# Altium schematic sheet PERIPHERAL.SchDoc
size A4
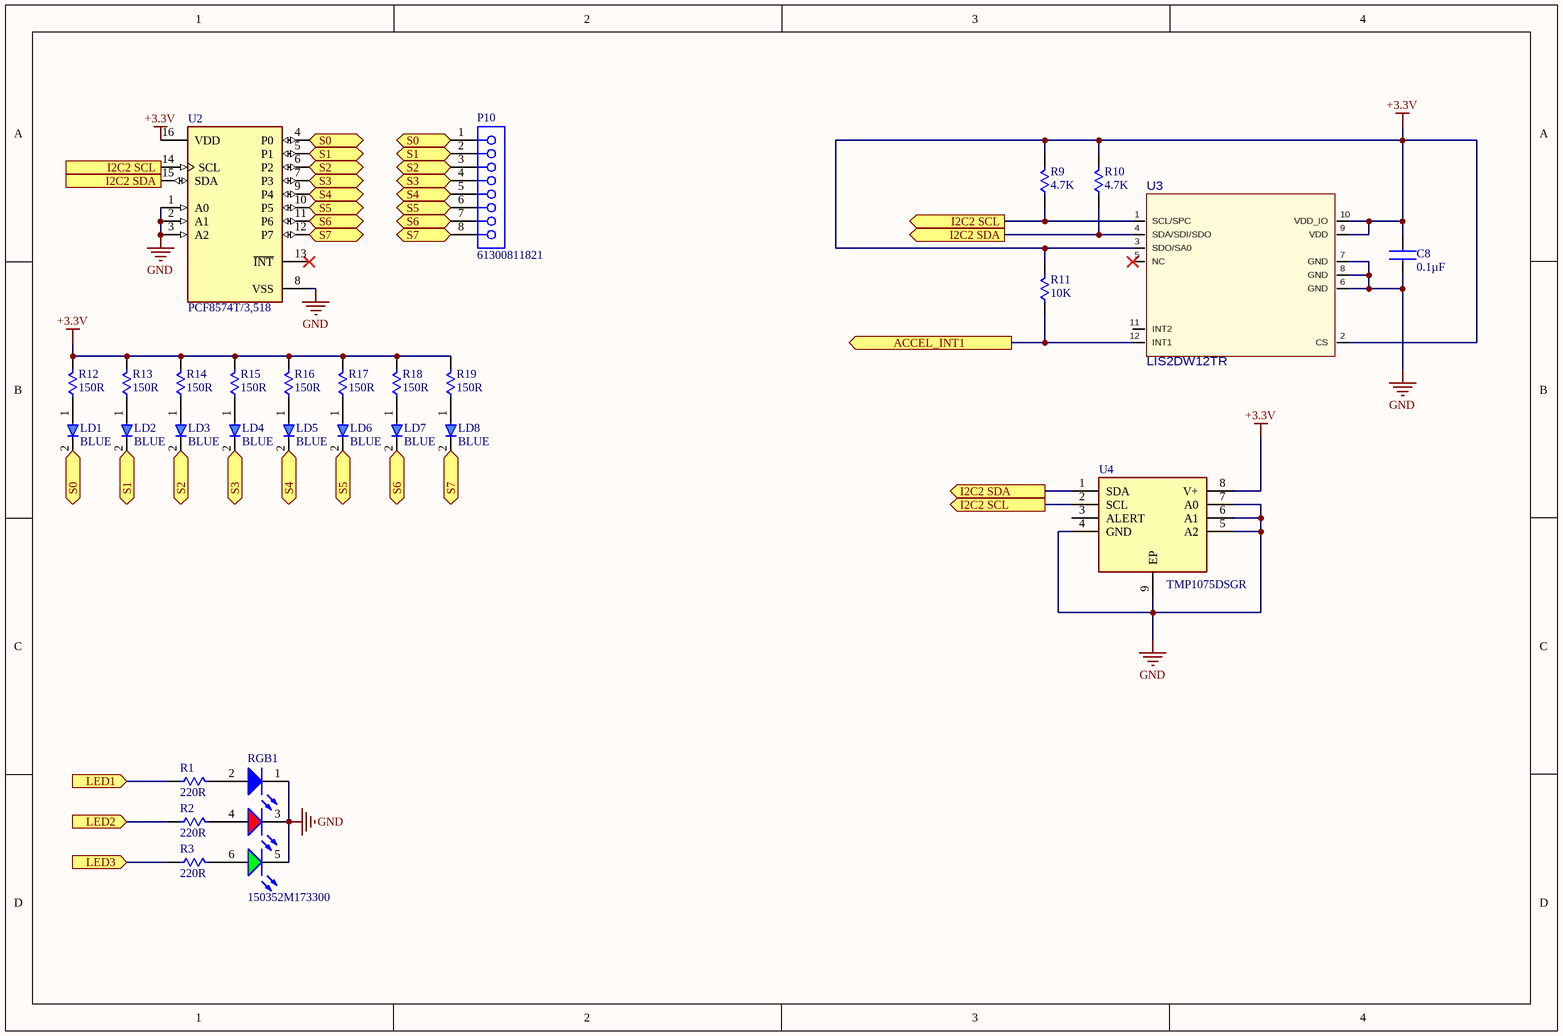
[diagram p0: PERIPHERAL.SchDoc]

## Parts
C8  0.1µF  [0402-CAP]
LD1  BLUE  [0603-LED-BLUE]
LD2  BLUE  [0603-LED-BLUE]
LD3  BLUE  [0603-LED-BLUE]
LD4  BLUE  [0603-LED-BLUE]
LD5  BLUE  [0603-LED-BLUE]
LD6  BLUE  [0603-LED-BLUE]
LD7  BLUE  [0603-LED-BLUE]
LD8  BLUE  [0603-LED-BLUE]
P10  61300811821  [61300811821]
R1  220R  [0603-RES]
R2  220R  [0603-RES]
R3  220R  [0603-RES]
R9  4.7K  [0603-RES]
R10  4.7K  [0603-RES]
R11  10K  [0603-RES]
R12  150R  [0603-RES]
R13  150R  [0603-RES]
R14  150R  [0603-RES]
R15  150R  [0603-RES]
R16  150R  [0603-RES]
R17  150R  [0603-RES]
R18  150R  [0603-RES]
R19  150R  [0603-RES]
RGB1  150352M173300  [WL-SFTW_3528_150352M173300]
U2  PCF8574T/3,518  [FP-SOT162-1-MFG]
U3  LIS2DW12TR  [PQFN50P200X200X100-12N]
U4  TMP1075DSGR  [SON50P200X200X80-9N]

## Ports
ACCEL_INT1 (out, see C0 DEVB V1R0[3B], C0 DEVB V1R0[4C]), I2C2 SCL (out, see C0 DEVB V1R0[3B], C0 DEVB V1R0[3D], C0 DEVB V1R0[4C], PERIPHERAL[1A], PERIPHERAL[3A]), I2C2 SCL (out, see C0 DEVB V1R0[3B], C0 DEVB V1R0[3D], C0 DEVB V1R0[4C], PERIPHERAL[1A], PERIPHERAL[3B]), I2C2 SCL (out, see C0 DEVB V1R0[3B], C0 DEVB V1R0[3D], C0 DEVB V1R0[4C], PERIPHERAL[3A], PERIPHERAL[3B]), I2C2 SDA (out, see C0 DEVB V1R0[3B], C0 DEVB V1R0[3C], C0 DEVB V1R0[4C], PERIPHERAL[1A], PERIPHERAL[3A]), I2C2 SDA (out, see C0 DEVB V1R0[3B], C0 DEVB V1R0[3C], C0 DEVB V1R0[4C], PERIPHERAL[1A], PERIPHERAL[3B]), I2C2 SDA (out, see C0 DEVB V1R0[3B], C0 DEVB V1R0[3C], C0 DEVB V1R0[4C], PERIPHERAL[3A], PERIPHERAL[3B]), LED1 (in, see C0 DEVB V1R0[3A], C0 DEVB V1R0[3B]), LED2 (in, see C0 DEVB V1R0[3A], C0 DEVB V1R0[3B]), LED3 (in, see C0 DEVB V1R0[3A], C0 DEVB V1R0[3B]), S0 (bidir, see PERIPHERAL[1A], PERIPHERAL[1B]), S0 (bidir, see PERIPHERAL[1A], PERIPHERAL[2A]), S0 (bidir, see PERIPHERAL[1B], PERIPHERAL[2A]), S1 (bidir, see PERIPHERAL[1A], PERIPHERAL[1B]), S1 (bidir, see PERIPHERAL[1A], PERIPHERAL[2A]), S1 (bidir, see PERIPHERAL[1B], PERIPHERAL[2A]), S2 (bidir, see PERIPHERAL[1A], PERIPHERAL[1B]), S2 (bidir, see PERIPHERAL[1A], PERIPHERAL[2A]), S2 (bidir, see PERIPHERAL[1B], PERIPHERAL[2A]), S3 (bidir, see PERIPHERAL[1A], PERIPHERAL[1B]), S3 (bidir, see PERIPHERAL[1A], PERIPHERAL[2A]), S3 (bidir, see PERIPHERAL[1B], PERIPHERAL[2A]), S4 (bidir, see PERIPHERAL[1A], PERIPHERAL[1B]), S4 (bidir, see PERIPHERAL[1A], PERIPHERAL[2A]), S4 (bidir, see PERIPHERAL[1B], PERIPHERAL[2A]), S5 (bidir, see PERIPHERAL[1A], PERIPHERAL[1B]), S5 (bidir, see PERIPHERAL[1A], PERIPHERAL[2A]), S5 (bidir, see PERIPHERAL[1B], PERIPHERAL[2A]), S6 (bidir, see PERIPHERAL[1A], PERIPHERAL[2A]), S6 (bidir, see PERIPHERAL[1A], PERIPHERAL[2B]), S6 (bidir, see PERIPHERAL[2A], PERIPHERAL[2B]), S7 (bidir, see PERIPHERAL[1A], PERIPHERAL[2A]), S7 (bidir, see PERIPHERAL[1A], PERIPHERAL[2B]), S7 (bidir, see PERIPHERAL[2A], PERIPHERAL[2B])

## Nets
+3.3V: C8.1 R9.2 R10.2 R11.2 R12.2 R13.2 R14.2 R15.2 R16.2 R17.2 R18.2 R19.2 U2.16(VDD) U3.2(CS) U3.3(SDO/SA0) U3.9(VDD) U3.10(VDD_IO) U4.8(V+)
GND: C8.2 RGB1.1(K) RGB1.3(K) RGB1.5(K) U2.1(A0) U2.2(A1) U2.3(A2) U2.8(VSS) U3.6(GND) U3.7(GND) U3.8(GND) U4.4(GND) U4.5(A2) U4.6(A1) U4.7(A0) U4.9(EP)
ACCEL_INT1: R11.1 U3.12(INT1) ; port ACCEL_INT1
I2C2 SCL: R9.1 U2.14(SCL) U3.1(SCL/SPC) U4.2(SCL) ; port I2C2 SCL
I2C2 SDA: R10.1 U2.15(SDA) U3.4(SDA/SDI/SDO) U4.1(SDA) ; port I2C2 SDA
LED1: R1.2 ; port LED1
LED2: R2.2 ; port LED2
LED3: R3.2 ; port LED3
S0: LD1.2(-) P10.1 U2.4(P0) ; port S0
S1: LD2.2(-) P10.2 U2.5(P1) ; port S1
S2: LD3.2(-) P10.3 U2.6(P2) ; port S2
S3: LD4.2(-) P10.4 U2.7(P3) ; port S3
S4: LD5.2(-) P10.5 U2.9(P4) ; port S4
S5: LD6.2(-) P10.6 U2.10(P5) ; port S5
S6: LD7.2(-) P10.7 U2.11(P6) ; port S6
S7: LD8.2(-) P10.8 U2.12(P7) ; port S7
NetLD1_1: LD1.1(+) R12.1
NetLD2_1: LD2.1(+) R13.1
NetLD3_1: LD3.1(+) R14.1
NetLD4_1: LD4.1(+) R15.1
NetLD5_1: LD5.1(+) R16.1
NetLD6_1: LD6.1(+) R17.1
NetLD7_1: LD7.1(+) R18.1
NetLD8_1: LD8.1(+) R19.1
NetR1_1: R1.1 RGB1.2(A)
NetR2_1: R2.1 RGB1.4(A)
NetR3_1: R3.1 RGB1.6(A)

Not connected (* = marked no-connect by the designer): U2 13(~{INT})*; U3 5(NC)* 11(INT2); U4 3(ALERT)

## Library data of the parts
C8 = GRM155R71H104KE14D: CAP CER 0.1UF 50V X7R 0402; Manufacturer: Murata; Material: Ceramic; Tolerance: 10%; Capacitance: 100nF; Dissipation Factor: 0.025%; Supplier 1: Digi-Key; Manufacturer Part Number: GRM155R71H104KE14D; Stock 1: 882567; Pricing 1: 1 = 0,10000, 10 = 0,04200, 100 = 0,01860, 500 = 0,01330, 1000 = 0,01045, 2500 = 0,00950, 5000 = 0,00874 (USD); RoHS: Yes; Mount: Surface Mount; Case/Package: 0402; Weight: 0.000212oz; Case Code (Metric): 1005; Case Code (Imperial): 0402; Dielectric Material: Ceramic; Min Operating Temperature: -55°C; Max Operating Temperature: 125°C; Packaging: Tape and Reel; Dielectric: X7R; Voltage Rating: 50V; Termination: SMD/SMT; Voltage: 50V; Composition: Ceramic; Voltage Rating (DC): 50V; Package Quantity: 10000; Length: 1mm; Height: 0.5mm; Width: 0.5mm; Thickness: 0.022inch; Depth: 0.5mm; REACH SVHC: No SVHC; Lead Free: Lead Free; ComponentLink1URL: http://www.mouser.com/ds/2/281/c02e-2905.pdf?src-supplier=Mouser; ComponentLink1Description: http://www.mouser.com/ds/2/281/c02e-2905.pdf?src-supplier=Mouser; ComponentLink2URL: http://www.farnell.com/datasheets/2079156.pdf?src-supplier=Farnell; ComponentLink2Description: http://www.farnell.com/datasheets/2079156.pdf?src-supplier=Farnell; ComponentLink3URL: http://components.arrow.com/part/dataview/0323_07030614?src-supplier=Arrow+Europe; ComponentLink3Description: http://components.arrow.com/part/dataview/0323_07030614?src-supplier=Arrow+Europe; ComponentLink4URL: https://search.murata.co.jp/Ceramy/image/img/A01X/G101/ENG/GRM155R71H104KE14-01.pdf?src-supplier=Digi-Key; ComponentLink4Description: https://search.murata.co.jp/Ceramy/image/img/A01X/G101/ENG/GRM155R71H104KE14-01.pdf?src-supplier=Digi-Key; ComponentLink5URL: http://psearch.en.murata.com/capacitor/product/GRM155R71H104KE14%23.pdf?src-supplier=Avnet; ComponentLink5Description: http://psearch.en.murata.com/capacitor/product/GRM155R71H104KE14%23.pdf?src-supplier=Avnet; ComponentLink6URL: http://www.farnell.com/datasheets/2079156.pdf?src-supplier=Element14; ComponentLink6Description: http://www.farnell.com/datasheets/2079156.pdf?src-supplier=Element14; ComponentLink7URL: http://www.farnell.com/datasheets/2079156.pdf?src-supplier=Newark; ComponentLink7Description: http://www.farnell.com/datasheets/2079156.pdf?src-supplier=Newark; Supplier Part Number 1: 490-10700-1-ND
LD1-LD8 = 150060BS75000: LED BLUE CLEAR 0603 SMD; Manufacturer: Wurth Electronics; Luminous Intensity: 145mcd; Forward Current: 30mA; Forward Voltage: 3.2V; Wavelength: 470nm; Viewing Angle: 140°; Lens Style: Clear,Rectangular; Test Current: 20mA; Supplier 1: Digi-Key; Manufacturer Part Number: 150060BS75000; Stock 1: 27240; Pricing 1: 1 = 0,16000, 50 = 0,14500, 100 = 0,12500, 500 = 0,10800 (USD); RoHS: Yes; Mount: Surface Mount; Case/Package: 0603; Color: Blue; Case Code (Metric): 1608; Case Code (Imperial): 0603; Min Operating Temperature: -40°C; Max Operating Temperature: 85°C; Package Quantity: 4000; Packaging: Cut Tape; Dominant Wavelength: 470nm; Length: 1.6mm; Height: 0.7mm; Width: 0.8mm; REACH SVHC: Unknown; ComponentLink1URL: https://datasheet.ciiva.com/29563/150060bs75000-29563034.pdf?src-supplier=Digi-Key; ComponentLink1Description: https://datasheet.ciiva.com/29563/150060bs75000-29563034.pdf?src-supplier=Digi-Key; ComponentLink2URL: https://datasheet.ciiva.com/29279/759426-da-01-en-chipled-0603-w-kl-blau-150060bs75000-29279193.pdf?src-supplier=Conrad; ComponentLink2Description: https://datasheet.ciiva.com/29279/759426-da-01-en-chipled-0603-w-kl-blau-150060bs75000-29279193.pdf?src-supplier=Conrad; ComponentLink3URL: https://datasheet.ciiva.com/48430/150060bs75000-eng-tds-48430039.pdf?src-supplier=Distrelec; ComponentLink3Description: https://datasheet.ciiva.com/48430/150060bs75000-eng-tds-48430039.pdf?src-supplier=Distrelec; ComponentLink4URL: https://datasheet.ciiva.com/22656/1911343-22656939.pdf?src-supplier=Element14; ComponentLink4Description: https://datasheet.ciiva.com/22656/1911343-22656939.pdf?src-supplier=Element14; ComponentLink5URL: https://datasheet.ciiva.com/29563/150060bs75000-29563035.pdf?src-supplier=Digi-Key; ComponentLink5Description: https://datasheet.ciiva.com/29563/150060bs75000-29563035.pdf?src-supplier=Digi-Key; ComponentLink6URL: https://datasheet.ciiva.com/29563/150060bs75000-29563036.pdf?src-supplier=Digi-Key; ComponentLink6Description: https://datasheet.ciiva.com/29563/150060bs75000-29563036.pdf?src-supplier=Digi-Key; Supplier Part Number 1: 732-4966-1-ND
P10 = CMP-1502-01327-3: NexarPartId: 61924723; Current Rating: 3A; Gender: Female; Contact Resistance: 20mΩ; Operating Supply Voltage: 250V; Lead Pitch: 2.54mm; RoHS: Non-Compliant; Orientation: Vertical; Number of Pins: 8
R1-R3 = CPF-A-0603B220RE: RES SMD 220 OHM 0.1% 1/16W 0603; Manufacturer: TE Connectivity; Temperature Coefficient: 25ppm/°C; Max Power Dissipation: 63mW; Supplier 1: Digi-Key; Manufacturer Part Number: CPF-A-0603B220RE; Stock 1: 4490; Pricing 1: 1=0.54, 10=0.384, 100=0.1999, 1000=0.10762, 2500=0.10616 (USD); Case/Package: 0603; Case Code (Imperial): 0603; Case Code (Metric): 1608; Min Operating Temperature: -55°C; Max Operating Temperature: 155°C; Resistance: 220R; Composition: Thin Film; Packaging: Tape and Reel; Tolerance: 0.1%; Number of Terminations: 2; Features: Moisture Resistant,Automotive AEC-Q200,Anti-Sulfur; Supplier Part Number 1: A123979CT-ND
R9 R10 = CRCW06034K70JNEA: RES SMD 4.7K OHM 5% 1/10W 0603; Manufacturer: Vishay; Resistance: 4.7kR; Power Rating: 100mW; Voltage Rating: 75V; Temperature Coefficient: 200ppm/°C; ComponentLink1URL: http://www.vishay.com/docs/20035/dcrcwe3.pdf; ComponentLink1Description: http://www.vishay.com/docs/20035/dcrcwe3.pdf; Supplier 1: Digi-Key; Manufacturer Part Number: CRCW06034K70JNEA; Stock 1: 30190; Pricing 1: 1 = 0,10000, 10 = 0,03200, 100 = 0,01310, 1000 = 0,00590, 2500 = 0,00512 (USD); RoHS: Yes; Mount: Surface Mount; Case/Package: 0603; Weight: 7.1E-05oz; Case Code (Imperial): 0603; Case Code (Metric): 1608; Contact Plating: Tin; Min Operating Temperature: -55°C; Max Operating Temperature: 155°C; Package Quantity: 1; Tolerance: 5%; Packaging: Tape and Reel; Termination: SMD/SMT; Composition: Thick Film; Number of Terminations: 2; Military Standard: Not; Max Power Dissipation: 100mW; Features: Automotive AEC-Q200; Voltage Rating (DC): 75V; Length: 1.55mm; Height: 0.45mm; Width: 0.85mm; Depth: 0.85mm; Radiation Hardening: No; REACH SVHC: Unknown; Lead Free: Lead Free; ComponentLink2URL: https://datasheet.ciiva.com/16215/dcrcwe3-16215767.pdf?src-supplier=Future+Electronics; ComponentLink2Description: https://datasheet.ciiva.com/16215/dcrcwe3-16215767.pdf?src-supplier=Future+Electronics; ComponentLink3URL: https://datasheet.ciiva.com/5546/dcrcwe3-109170-5546457.pdf?src-supplier=Mouser; ComponentLink3Description: https://datasheet.ciiva.com/5546/dcrcwe3-109170-5546457.pdf?src-supplier=Mouser; ComponentLink4URL: https://datasheet.ciiva.com/2461/dcrcwe3-2461995.pdf?src-supplier=Digi-Key; ComponentLink4Description: https://datasheet.ciiva.com/2461/dcrcwe3-2461995.pdf?src-supplier=Digi-Key; ComponentLink5URL: https://datasheet.ciiva.com/16755/70201119-16755067.pdf?src-supplier=Allied+Electronics; ComponentLink5Description: https://datasheet.ciiva.com/16755/70201119-16755067.pdf?src-supplier=Allied+Electronics; ComponentLink6URL: https://datasheet.ciiva.com/26821/getdatasheetpartid-88043-26821115.pdf?src-supplier=Verical; ComponentLink6Description: https://datasheet.ciiva.com/26821/getdatasheetpartid-88043-26821115.pdf?src-supplier=Verical; ComponentLink7URL: https://datasheet.ciiva.com/2461/dcrcwe3-2461996.pdf?src-supplier=Digi-Key; ComponentLink7Description: https://datasheet.ciiva.com/2461/dcrcwe3-2461996.pdf?src-supplier=Digi-Key; ComponentLink8URL: https://datasheet.ciiva.com/2461/dcrcwe3-2461997.pdf?src-supplier=Digi-Key; ComponentLink8Description: https://datasheet.ciiva.com/2461/dcrcwe3-2461997.pdf?src-supplier=Digi-Key; ComponentLink9URL: https://datasheet.ciiva.com/16772/70201119-16772847.pdf?src-supplier=Allied+Electronics; ComponentLink9Description: https://datasheet.ciiva.com/16772/70201119-16772847.pdf?src-supplier=Allied+Electronics; Supplier Part Number 1: 541-4.7KGCT-ND
R11 = RC0603FR-0710KL: RES SMD 10K OHM 1% 1/10W 0603; Manufacturer 1: Yageo; Resistance: 10kR; Temperature Coefficient: 100ppm/°C; Voltage Rating (DC): 50V; Power Rating: 100mW; Voltage Rating: 75V; Supplier 1: Digi-Key; Manufacturer Part Number 1: RC0603FR-0710KL; Stock 1: 45404531; Pricing 1: 1=0,10000, 10=0,02300, 100=0,00940, 1000=0,00421, 2500=0,00366 (USD); RoHS: Yes; Case/Package: 0603; Number of Pins: 2; Weight: 7.1E-05oz; Case Code (Imperial): 0603; Case Code (Metric): 1608; Min Operating Temperature: -55°C; Max Operating Temperature: 155°C; Tolerance: 1%; Composition: Thick Film; Packaging: Tape and Reel; Military Standard: Not; Termination: SMD/SMT; Length: 1.6mm; Height: 0.45mm; Width: 0.8mm; Depth: 0.8mm; Lead Pitch: 0.3mm; REACH SVHC: No SVHC; Lead Free: Lead Free; ComponentLink1URL: https://datasheet.ciiva.com/7660/38590-7660789.pdf?src-supplier=Element14; ComponentLink1Description: https://datasheet.ciiva.com/7660/38590-7660789.pdf?src-supplier=Element14; ComponentLink2URL: https://datasheet.ciiva.com/22747/443971-22747519.pdf?src-supplier=Element14; ComponentLink2Description: https://datasheet.ciiva.com/22747/443971-22747519.pdf?src-supplier=Element14; ComponentLink3URL: https://datasheet.ciiva.com/15189/getdatasheetpartid-409289-15189591.pdf?src-supplier=Verical; ComponentLink3Description: https://datasheet.ciiva.com/15189/getdatasheetpartid-409289-15189591.pdf?src-supplier=Verical; ComponentLink4URL: https://datasheet.ciiva.com/46440/1868787-46440891.pdf?src-supplier=Element14; ComponentLink4Description: https://datasheet.ciiva.com/46440/1868787-46440891.pdf?src-supplier=Element14; ComponentLink5URL: https://datasheet.ciiva.com/7983/443971-7983596.pdf?src-supplier=Element14; ComponentLink5Description: https://datasheet.ciiva.com/7983/443971-7983596.pdf?src-supplier=Element14; ComponentLink6URL: https://datasheet.ciiva.com/7746/1738695-7746239.pdf?src-supplier=Element14; ComponentLink6Description: https://datasheet.ciiva.com/7746/1738695-7746239.pdf?src-supplier=Element14; Supplier Part Number 1: 311-10.0KHRCT-ND
R12-R19 = CRGCQ0603F150R: RES SMD 150 OHM 1% 1/10W 0603; Manufacturer: Panasonic; Manufacturer Part Number: ERJ-3EKF75R0V; Resistance: 75R; Power Rating: 100mW; Voltage Rating: 75V; Temperature Coefficient: 100ppm/°C; Voltage Rating (DC): 50V; Supplier 1: Digi-Key; Stock 1: 1132238; Pricing 1: 1 = 0,10000, 10 = 0,06500, 100 = 0,02640, 1000 = 0,01186, 2500 = 0,01029 (USD); RoHS: Yes; Mount: Surface Mount; Case/Package: 0603; Case Code (Metric): 1608; Case Code (Imperial): 0603; Contact Plating: Tin; Min Operating Temperature: -55°C; Max Operating Temperature: 155°C; Tolerance: 1%; Packaging: Tape and Reel; Package Quantity: 1; Composition: Thick Film; Number of Terminations: 2; Military Standard: Not; Termination: SMD/SMT; Max Power Dissipation: 100mW; Features: Automotive AEC-Q200; Working Voltage: 75V; Length: 1.6mm; Height: 0.45mm; Width: 0.031inch; Depth: 0.8mm; Radiation Hardening: No; REACH SVHC: Unknown; Lead Free: Lead Free; Supplier Part Number 1: P75.0HCT-ND; Supplier 2: Digi-Key; Stock 2: 98043; Pricing 2: 1 = 0,10000, 10 = 0,03100, 100 = 0,01260, 1000 = 0,00568, 2500 = 0,00493 (USD); ComponentLink1URL: https://www.te.com/commerce/DocumentDelivery/DDEController?Action=srchrtrv&amp;DocNm=1773204-3&amp;DocType=DS&amp;DocLang=English&src-supplier=Digi-Key; ComponentLink1Description: https://www.te.com/commerce/DocumentDelivery/DDEController?Action=srchrtrv&amp;DocNm=1773204-3&amp;DocType=DS&amp;DocLang=English&src-supplier=Digi-Key; ComponentLink2URL: https://www.te.com/commerce/DocumentDelivery/DDEController?Action=srchrtrv&DocNm=1773204-3&DocType=DS&DocLang=English&src-supplier=Digi-Key; ComponentLink2Description: https://www.te.com/commerce/DocumentDelivery/DDEController?Action=srchrtrv&DocNm=1773204-3&DocType=DS&DocLang=English&src-supplier=Digi-Key; Supplier Part Number 2: A129678CT-ND
RGB1 = CMP-207942-000002-2: LED RGB CLEAR 6PLCC SMD; NexarPartId: 90235580; Reverse Voltage: 5V; Power Dissipation: 72mW; Forward Current: 100mA; Viewing Angle: 120°; Peak Wavelength: 465nm; Forward Voltage: 2V; Luminous Intensity: 400mcd; Max Junction Temperature (Tj): 115°C; Dominant Wavelength: 520nm; Max Reverse Voltage (DC): 5V; RoHS: Non-Compliant; Min Operating Temperature: -40°C; Packaging: Tape and Reel; Color: Blue, Green, Red; Height: 1.85mm; Max Operating Temperature: 85°C
U2 = CMP-10112-000010-1: IC I/O EXPANDER I2C 8B 16SOIC; Manufacturer: NXP Semiconductors; Frequency: 100kHz; Max Supply Voltage: 6V; Standoff Height: 0.1mm; Nominal Supply Current: 40uA; Max Junction Temp: +125°C; Min Supply Voltage: 2.5V; Number Of I/Os: 8; Manufacturer Part Number: PCF8574T/3,518; Footprint Url: https://www.nxp.com/docs/en/package-information/SOT162-1.pdf; ComponentLink2URL: https://www.nxp.com/docs/en/data-sheet/PCF8574_PCF8574A.pdf; Automotive: No; Digikey Description: IC I/O EXPANDER I2C 8B 16SOIC; Mouser Description: PCF8574 Series 2.5 - 6V Remote 8-bit I/O Expander for I2C-bus - SOIC-16; Ipc Land Pattern Name: SOIC127P1032X265-16; Interface: I2C; Octopart: https://octopart.com/pcf8574t%2F3%2C518-nxp+semiconductors-10470852; Ambient Temperature Range Low: -40°C; Lead Free: Yes; Device Class L2: Interface ICs; Temperature Range High: +85°C; Device Class L1: Integrated Circuits (ICs); Package: SOT162-1; ComponentLink2Description: Datasheet; Device Class L3: I/O Expanders; Temperature: -40°C to +85°C; Ambient Temperature Range High: +85°C; Height: 2.65mm; Category: IC; RoHS: TRUE; Temperature Range Low: -40°C
U3 = LIS2DW12TR: PCB DECAL: LGA-12; Geometry.Height: 1.27000mm; VALOR: LIS2DW12TR
U4 = TMP1075DSGR: High-accuracy upgrade to industry standard LM75 / TMP75 I2C temperature sensor; Manufacturer_Name: Texas Instruments; Geometry.Height: 0.8mm; Mouser Part Number: 595-TMP1075DSGR; Mouser Price/Stock: https://www.mouser.co.uk/ProductDetail/Texas-Instruments/TMP1075DSGR?qs=gZXFycFWdAOidBdJW42bRw%3D%3D; Manufacturer_Part_Number: TMP1075DSGR; Datasheet Link: http://www.ti.com/lit/ds/symlink/tmp1075.pdf